# EAGLE design MS_Electron_SC (EAGLE 9.3.2)
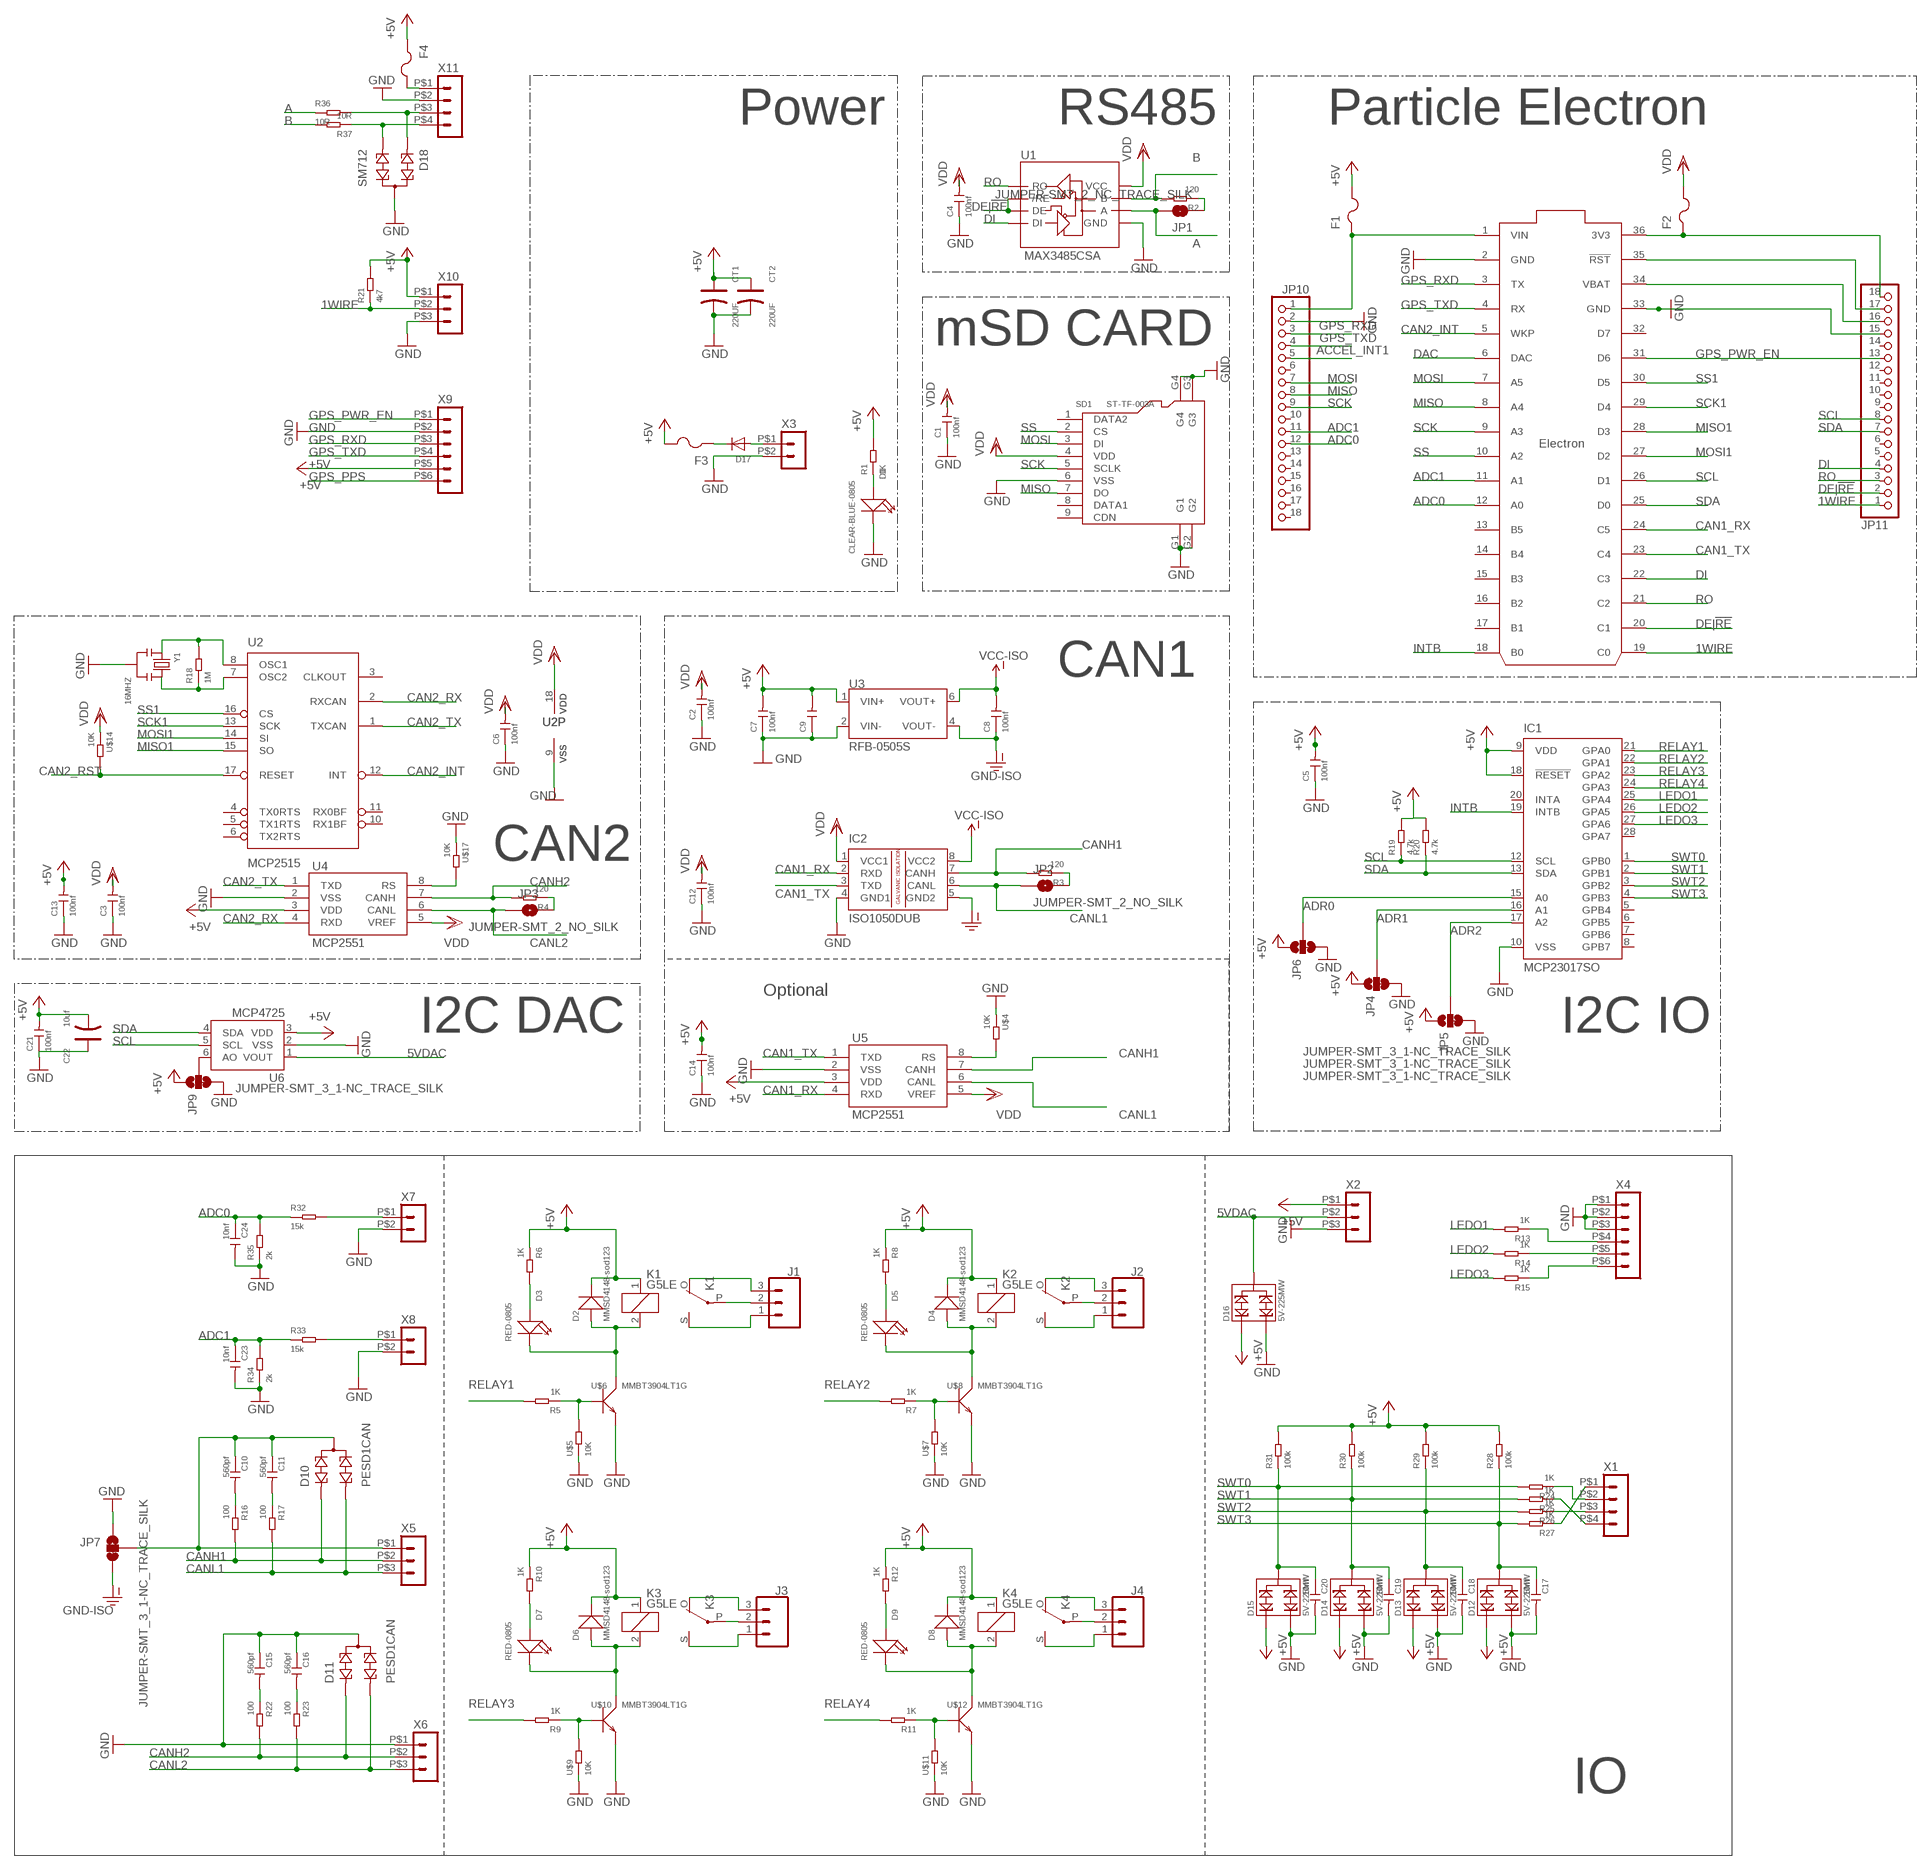
[diagram p0: schematic, sheet 1]

## Parts
C1  100nf  CERAMIC-100NF-50V-10%-X7R(0805)  [C0805]
C2  100nf  CERAMIC-100NF-50V-10%-X7R(0805)  [C0805]
C3  100nf  CERAMIC-100NF-50V-10%-X7R(0805)  [C0805]
C4  100nf  CERAMIC-100NF-50V-10%-X7R(0805)  [C0805]
C5  100nf  CERAMIC-100NF-50V-10%-X7R(0805)  [C0805]
C6  100nf  CERAMIC-100NF-50V-10%-X7R(0805)  [C0805]
C7  100nf  CERAMIC-100NF-50V-10%-X7R(0805)  [C0805]
C8  100nf  CERAMIC-100NF-50V-10%-X7R(0805)  [C0805]
C9  CERAMIC-22UF-16V-10%-X7R(1206)  [C1206]
C10  560pf  CERAMIC-10NF-50V-5%-X7R(0805)  [C0805]
C11  560pf  CERAMIC-10NF-50V-5%-X7R(0805)  [C0805]
C12  100nf  CERAMIC-100NF-50V-10%-X7R(0805)  [C0805]
C13  100nf  CERAMIC-100NF-50V-10%-X7R(0805)  [C0805]
C14  100nf  CERAMIC-100NF-50V-10%-X7R(0805)  [C0805]
C15  560pf  CERAMIC-10NF-50V-5%-X7R(0805)  [C0805]
C16  560pf  CERAMIC-10NF-50V-5%-X7R(0805)  [C0805]
C17  10nf  CERAMIC-10NF-50V-5%-X7R(0805)  [C0805]
C18  10nf  CERAMIC-10NF-50V-5%-X7R(0805)  [C0805]
C19  10nf  CERAMIC-10NF-50V-5%-X7R(0805)  [C0805]
C20  10nf  CERAMIC-10NF-50V-5%-X7R(0805)  [C0805]
C21  100nf  CERAMIC-100NF-50V-10%-X7R(0805)  [C0805]
C22  10uf  TANTALUM-SMD-10UF-10V-10%(AVX-A)  [AVX-A]
C23  10nf  CERAMIC-10NF-50V-5%-X7R(0805)  [C0805]
C24  10nf  CERAMIC-10NF-50V-5%-X7R(0805)  [C0805]
CT1  220UF  ALUMINUM-SMD-220UF-16V(D6.3-H7.7MM)  [ELECTRO-SMD-C-6MM]
CT2  220UF  ALUMINUM-SMD-220UF-16V(D6.3-H7.7MM)  [ELECTRO-SMD-C-6MM]
D1  CLEAR-BLUE-0805  SMD-LED-CLEAR-BLUE(0805)  [LED-0805]
D2  MMSD4148-sod123  SMD-DIODE-100V-200MA(SOD-123)  [SOD-123]
D3  RED-0805  SMD-LED-CLEAR-RED(0805)  [LED-0805]
D4  MMSD4148-sod123  SMD-DIODE-100V-200MA(SOD-123)  [SOD-123]
D5  RED-0805  SMD-LED-CLEAR-RED(0805)  [LED-0805]
D6  MMSD4148-sod123  SMD-DIODE-100V-200MA(SOD-123)  [SOD-123]
D7  RED-0805  SMD-LED-CLEAR-RED(0805)  [LED-0805]
D8  MMSD4148-sod123  SMD-DIODE-100V-200MA(SOD-123)  [SOD-123]
D9  RED-0805  SMD-LED-CLEAR-RED(0805)  [LED-0805]
D10  PESD1CAN  [SOT23]
D11  PESD1CAN  [SOT23]
D12  5V-225MW  SMD-DIODE-TVS-5V-225MW(SOT-23)  [SOT-23]
D13  5V-225MW  SMD-DIODE-TVS-5V-225MW(SOT-23)  [SOT-23]
D14  5V-225MW  SMD-DIODE-TVS-5V-225MW(SOT-23)  [SOT-23]
D15  5V-225MW  SMD-DIODE-TVS-5V-225MW(SOT-23)  [SOT-23]
D16  5V-225MW  SMD-DIODE-TVS-5V-225MW(SOT-23)  [SOT-23]
D17  DIODESMA  [SMADIODE]
D18  SM712  PESD1CAN  [SOT23]
F1  PTCFUSE-1812  [1812]
F2  PTCFUSE-1812  [1812]
F3  PTCFUSE-1812  [1812]
F4  PTCFUSE-1812  [1812]
IC1  MCP23017SO  [SO28W]
IC2  ISO1050DUB  [DUB-R-PDSO-G8]
J1  CONN_03SCREW  [SCREWTERMINAL-3.5MM-3]
J2  CONN_03SCREW  [SCREWTERMINAL-3.5MM-3]
J3  CONN_03SCREW  [SCREWTERMINAL-3.5MM-3]
J4  CONN_03SCREW  [SCREWTERMINAL-3.5MM-3]
JP1  JUMPER-SMT_2_NC_TRACE_SILK  [SMT-JUMPER_2_NC_TRACE_SILK]
JP2  JUMPER-SMT_2_NO_SILK  [SMT-JUMPER_2_NO_SILK]
JP3  JUMPER-SMT_2_NO_SILK  [SMT-JUMPER_2_NO_SILK]
JP4  JUMPER-SMT_3_1-NC_TRACE_SILK  [SMT-JUMPER_3_1-NC_TRACE_SILK]
JP5  JUMPER-SMT_3_1-NC_TRACE_SILK  [SMT-JUMPER_3_1-NC_TRACE_SILK]
JP6  JUMPER-SMT_3_1-NC_TRACE_SILK  [SMT-JUMPER_3_1-NC_TRACE_SILK]
JP7  JUMPER-SMT_3_1-NC_TRACE_SILK  [SMT-JUMPER_3_1-NC_TRACE_SILK]
JP9  JUMPER-SMT_3_1-NC_TRACE_SILK  [SMT-JUMPER_3_1-NC_TRACE_SILK]
JP10  PINHD-1X18-BIG  [1X18-BIG]
JP11  PINHD-1X18-BIG  [1X18-BIG]
K1  G5LE  [G5LE]
K2  G5LE  [G5LE]
K3  G5LE  [G5LE]
K4  G5LE  [G5LE]
R1  1K  SMD-RES-1K-5%-1/8W(0805)  [R0805]
R2  120  SMD-RES-120R-1%-1/8W(0805)  [R0805]
R3  120  SMD-RES-120R-1%-1/8W(0805)  [R0805]
R4  120  SMD-RES-120R-1%-1/8W(0805)  [R0805]
R5  1K  SMD-RES-1K-5%-1/8W(0805)  [R0805]
R6  1K  SMD-RES-1K-5%-1/8W(0805)  [R0805]
R7  1K  SMD-RES-1K-5%-1/8W(0805)  [R0805]
R8  1K  SMD-RES-1K-5%-1/8W(0805)  [R0805]
R9  1K  SMD-RES-1K-5%-1/8W(0805)  [R0805]
R10  1K  SMD-RES-1K-5%-1/8W(0805)  [R0805]
R11  1K  SMD-RES-1K-5%-1/8W(0805)  [R0805]
R12  1K  SMD-RES-1K-5%-1/8W(0805)  [R0805]
R13  1K  SMD-RES-1K-5%-1/8W(0805)  [R0805]
R14  1K  SMD-RES-1K-5%-1/8W(0805)  [R0805]
R15  1K  SMD-RES-1K-5%-1/8W(0805)  [R0805]
R16  100  SMD-RES-100R-1%-1/8W(0805)  [R0805]
R17  100  SMD-RES-100R-1%-1/8W(0805)  [R0805]
R18  1M  SMD-RES-1M-1%-1/8W(0805)  [R0805]
R19  4.7k  SMD-RES-4.7K-1%-1/8W(0805)  [R0805]
R20  4.7k  SMD-RES-4.7K-1%-1/8W(0805)  [R0805]
R21  4k7  SMD-RES-4.7K-1%-1/8W(0805)  [R0805]
R22  100  SMD-RES-100R-1%-1/8W(0805)  [R0805]
R23  100  SMD-RES-100R-1%-1/8W(0805)  [R0805]
R24  1K  SMD-RES-1K-5%-1/8W(0805)  [R0805]
R25  1K  SMD-RES-1K-5%-1/8W(0805)  [R0805]
R26  1K  SMD-RES-1K-5%-1/8W(0805)  [R0805]
R27  1K  SMD-RES-1K-5%-1/8W(0805)  [R0805]
R28  100k  SMD-RES-100K-1%-1/8W(0805)  [R0805]
R29  100k  SMD-RES-100K-1%-1/8W(0805)  [R0805]
R30  100k  SMD-RES-100K-1%-1/8W(0805)  [R0805]
R31  100k  SMD-RES-100K-1%-1/8W(0805)  [R0805]
R32  15k  SMD-RES-15K-5%-1/8W(0805)  [R0805]
R33  15k  SMD-RES-15K-5%-1/8W(0805)  [R0805]
R34  2k  SMD-RES-2K-1%-1/8W(0805)  [R0805]
R35  2k  SMD-RES-2K-1%-1/8W(0805)  [R0805]
R36  10R  SMD-RES-4.7K-1%-1/8W(0805)  [R0805]
R37  10R  SMD-RES-4.7K-1%-1/8W(0805)  [R0805]
SD1  ST-TF-003A  MICRO-SD-CARD-SOCKET-9P(ST-TF-003A)  [MICRO-SD9+4P-SMD-16.1X14.5X1.85MM]
U1  MAX3485CSA  RS485SOIC  [SO08]
U2  MCP2515  MCP2515(MCP2510)SO  [SO18W]
U3  RFB-0505S  [RFB-0505S]
U4  MCP2551  [SO08]
U5  MCP2551  [SO08]
U6  MCP4725  MCP4725SOT-23  [SOT23-6]
U$1  ELECTRON_WITH_HEADERS  [ELECTRON]
U$4  10K  SMD-RES-10K-1%-1/8W(0805)  [R0805]
U$5  10K  SMD-RES-10K-1%-1/8W(0805)  [R0805]
U$6  MMBT3904LT1G  SMD-TRANSISTORS-NPN-40V-200MA-MMBT3904LT1G(SOT-23)  [SOT-23]
U$7  10K  SMD-RES-10K-1%-1/8W(0805)  [R0805]
U$8  MMBT3904LT1G  SMD-TRANSISTORS-NPN-40V-200MA-MMBT3904LT1G(SOT-23)  [SOT-23]
U$9  10K  SMD-RES-10K-1%-1/8W(0805)  [R0805]
U$10  MMBT3904LT1G  SMD-TRANSISTORS-NPN-40V-200MA-MMBT3904LT1G(SOT-23)  [SOT-23]
U$11  10K  SMD-RES-10K-1%-1/8W(0805)  [R0805]
U$12  MMBT3904LT1G  SMD-TRANSISTORS-NPN-40V-200MA-MMBT3904LT1G(SOT-23)  [SOT-23]
U$14  10K  SMD-RES-10K-1%-1/8W(0805)  [R0805]
U$17  10K  SMD-RES-10K-1%-1/8W(0805)  [R0805]
X1  HEADER_POS4_43045-0401  [43045-0400]
X2  HEADER_POS3_43650-0300  [43650-0300]
X3  HEADER_POS2_43650-0200  [43650-0200]
X4  HEADER_POS6_43045-0600  [43045-0600]
X5  HEADER_POS3_43650-0300  [43650-0300]
X6  HEADER_POS3_43650-0300  [43650-0300]
X7  HEADER_POS2_43650-0200  [43650-0200]
X8  HEADER_POS2_43650-0200  [43650-0200]
X9  HEADER_POS6_43045-0600  [43045-0600]
X10  HEADER_POS3_43650-0300  [43650-0300]
X11  HEADER_POS4_43045-0401  [43045-0400]
Y1  16MHZ  SMD-RESONATOR-16MHZ-15PF-0.5%-40R(3P-3.2X1.3MM)  [X3-SMD-3.6X1.3X0.8MM]

## Nets
1WIRE: JP11.1 R21.1 U$1.19(C0) X10.P$2
5VDAC: D16.3 U6.1(VOUT) X2.P$2
+5V: C5.2 C7.2 C9.2 C13.2 C14.2 C21.2 C22.- CT1.+ CT2.+ D2.- D4.- D6.- D8.- D12.1 D13.1 D14.1 D15.1 D16.1 F1.2 F3.2 F4.1 IC1.9(VDD) IC1.18(!RESET) JP4.1 JP5.1 JP6.1 JP9.1 K1.1 K2.1 K3.1 K4.1 R1.2 R6.1 R8.1 R10.1 R12.1 R19.2 R20.2 R21.2 R28.2 R29.2 R30.2 R31.2 U3.1(VIN+) U4.3(VDD) U5.3(VDD) U6.3(VDD) X2.P$1 X9.P$5 X10.P$1
A: JP1.2 R36.1 U1.6(A)
ACCEL_INT1: JP10.5
ADC0: C24.1 JP10.12 R32.1 R35.2 U$1.12(A0)
ADC1: C23.1 JP10.11 R33.1 R34.2 U$1.11(A1)
ADR0: IC1.15(A0) JP6.2
ADR1: IC1.16(A1) JP4.2
ADR2: IC1.17(A2) JP5.2
B: R2.2 R37.2 U1.7(B)
CAN1_RX: IC2.2(RXD) U5.4(RXD) U$1.24(C5)
CAN1_TX: IC2.3(TXD) U5.1(TXD) U$1.23(C4)
CAN2_INT: U2.12(INT) U$1.5(WKP)
CAN2_RST: U2.17(RESET) U$14.2
CAN2_RX: U2.2(RXCAN) U4.4(RXD)
CAN2_TX: U2.1(TXCAN) U4.1(TXD)
CANH1: D10.1 IC2.7(CANH) R3.2 R16.2 U5.7(CANH) X5.P$2
CANH2: D11.1 R4.2 R22.2 U4.7(CANH) X6.P$2
CANL1: D10.2 IC2.6(CANL) JP2.1 R17.2 U5.6(CANL) X5.P$3
CANL2: D11.2 JP3.1 R23.2 U4.6(CANL) X6.P$3
DAC: U$1.6(DAC)
DE|!RE: JP11.2 U1.2(/RE) U1.3(DE) U$1.20(C1)
DI: JP11.4 U1.4(DI) U$1.22(C3)
GND: C1.1 C2.1 C3.1 C4.1 C5.1 C6.1 C7.1 C9.1 C12.1 C13.1 C14.1 C15.1 C16.1 C17.2 C18.2 C19.2 C20.2 C21.1 C22.+ C23.2 C24.2 CT1.- CT2.- D1.- D11.3 D12.2 D13.2 D14.2 D15.2 D16.2 D18.3 IC1.10(VSS) IC2.4(GND1) JP4.3 JP5.3 JP6.3 JP7.1 JP9.3 JP10.2 JP11.15 R34.1 R35.1 SD1.6(VSS) SD1.G1 SD1.G2 SD1.G3 SD1.G4 U1.5(GND) U2.9(VSS) U3.2(VIN-) U4.2(VSS) U5.2(VSS) U6.2(VSS) U$1.2(GND) U$1.33(GND) U$4.1 U$5.1 U$6.2(E) U$7.1 U$8.2(E) U$9.1 U$10.2(E) U$11.1 U$12.2(E) U$17.1 X2.P$3 X3.P$2 X4.P$1 X4.P$2 X4.P$3 X6.P$1 X7.P$2 X8.P$2 X9.P$2 X10.P$3 X11.P$2 Y1.2
GND-ISO: C8.1 IC2.5(GND2) JP7.3 U3.4(VOUT-)
GPS_PPS: X9.P$6
GPS_PWR_EN: JP11.13 U$1.31(D6) X9.P$1
GPS_RXD: JP10.3 U$1.3(TX) X9.P$3
GPS_TXD: JP10.4 U$1.4(RX) X9.P$4
INTB: IC1.19(INTB) U$1.18(B0)
LEDO1: IC1.25(GPA4) R13.2
LEDO2: IC1.26(GPA5) R14.2
LEDO3: IC1.27(GPA6) R15.2
MISO: JP10.8 SD1.7(DO) U$1.8(A4)
MISO1: U2.15(SO) U$1.28(D3)
MOSI: JP10.7 SD1.3(DI) U$1.7(A5)
MOSI1: U2.14(SI) U$1.27(D2)
N$1: D1.+ R1.1
N$2: JP2.2 R3.1
N$3: JP1.1 R2.1
N$4: JP3.2 R4.1
N$5: R5.1 U$5.2 U$6.1(B)
N$6: D2.+ D3.- K1.2 U$6.3(C)
N$7: D3.+ R6.2
N$8: J1.2 K1.P(2:P)
N$9: J1.3 K1.O(2:O)
N$10: J1.1 K1.S(2:S)
N$11: D4.+ D5.- K2.2 U$8.3(C)
N$12: R7.1 U$7.2 U$8.1(B)
N$13: D5.+ R8.2
N$14: J3.2 K3.P(2:P)
N$15: J2.3 K2.O(2:O)
N$16: J2.1 K2.S(2:S)
N$17: D6.+ D7.- K3.2 U$10.3(C)
N$18: R9.1 U$9.2 U$10.1(B)
N$19: D7.+ R10.2
N$20: J2.2 K2.P(2:P)
N$21: J3.3 K3.O(2:O)
N$22: J3.1 K3.S(2:S)
N$23: D8.+ D9.- K4.2 U$12.3(C)
N$24: R11.1 U$11.2 U$12.1(B)
N$25: D9.+ R12.2
N$26: J4.2 K4.P(2:P)
N$27: J4.3 K4.O(2:O)
N$28: J4.1 K4.S(2:S)
N$29: R14.1 X4.P$5
N$30: R13.1 X4.P$4
N$32: R15.1 X4.P$6
N$35: F2.1 JP11.18 U$1.36(3V3)
N$36: U5.8(RS) U$4.2
N$37: C11.2 R17.1
N$38: C10.2 R16.1
N$39: R18.1 U2.7(OSC2) Y1.3
N$40: R18.2 U2.8(OSC1) Y1.1
N$41: C10.1 C11.1 D10.3 JP7.2 X5.P$1
N$42: C16.2 R23.1
N$43: U4.8(RS) U$17.2
N$44: C15.2 R22.1
N$45: R24.1 X1.P$2
N$46: R27.1 X1.P$1
N$47: R25.1 X1.P$4
N$48: R26.1 X1.P$3
N$49: JP9.2 U6.6(AO)
N$50: R33.2 X8.P$1
N$51: R32.2 X7.P$1
N$52: JP11.17 U$1.35(!RST)
N$53: JP11.16 U$1.34(VBAT)
N$54: F1.1 JP10.1 U$1.1(VIN)
N$55: D17.A X3.P$1
N$56: D17.C F3.1
N$57: D18.1 R36.2 X11.P$3
N$58: D18.2 R37.1 X11.P$4
N$60: F4.2 X11.P$1
RELAY1: IC1.21(GPA0) R5.2
RELAY2: IC1.22(GPA1) R7.2
RELAY3: IC1.23(GPA2) R9.2
RELAY4: IC1.24(GPA3) R11.2
RO: JP11.3 U1.1(RO) U$1.21(C2)
SCK: JP10.9 SD1.5(SCLK) U$1.9(A3)
SCK1: U2.13(SCK) U$1.29(D4)
SCL: IC1.12(SCL) JP11.8 R19.1 U6.5(SCL) U$1.26(D1)
SDA: IC1.13(SDA) JP11.7 R20.1 U6.4(SDA) U$1.25(D0)
SS: SD1.2(CS) U$1.10(A2)
SS1: U2.16(CS) U$1.30(D5)
SWT0: C20.1 D15.3 IC1.1(GPB0) R24.2 R31.1
SWT1: C19.1 D14.3 IC1.2(GPB1) R25.2 R30.1
SWT2: C18.1 D13.3 IC1.3(GPB2) R26.2 R29.1
SWT3: C17.1 D12.3 IC1.4(GPB3) R27.2 R28.1
VCC-ISO: C8.2 IC2.8(VCC2) U3.6(VOUT+)
VDD: C1.2 C2.2 C3.2 C4.2 C6.2 C12.2 F2.2 IC2.1(VCC1) SD1.4(VDD) U1.8(VCC) U2.18(VDD) U4.5(VREF) U5.5(VREF) U$14.1
Unconnected: IC1.5(GPB4) IC1.6(GPB5) IC1.7(GPB6) IC1.8(GPB7) IC1.20(INTA) IC1.28(GPA7) JP10.6 JP10.10 JP10.13 JP10.14 JP10.15 JP10.16 JP10.17 JP10.18 JP11.5 JP11.6 JP11.9 JP11.10 JP11.11 JP11.12 JP11.14 SD1.1(DATA2) SD1.8(DATA1) SD1.9(CDN) U2.3(CLKOUT) U2.4(TX0RTS) U2.5(TX1RTS) U2.6(TX2RTS) U2.10(RX1BF) U2.11(RX0BF) U$1.13(B5) U$1.14(B4) U$1.15(B3) U$1.16(B2) U$1.17(B1) U$1.32(D7)

## Notes on the sheet
- Power | RS485 | Particle Electron
- mSD CARD
- CAN1
- CAN2
- Optional
- I2C DAC | I2C IO
- IO

## Library data of the parts
C1-C8 C12-C14 C21 = OPL_Capacitor:CERAMIC-100NF-50V-10%-X7R(0805): 302010165; MPN: CC0805KRX7R9BB104
C9 = OPL_Capacitor:CERAMIC-22UF-16V-10%-X7R(1206): 302010182
C10 C11 C15 C16 = OPL_Capacitor:CERAMIC-10NF-50V-5%-X7R(0805): 302010175; MPN: CC0805JRX7R9BB103; VALUE: 10nf
C17-C20 C23 C24 = OPL_Capacitor:CERAMIC-10NF-50V-5%-X7R(0805): 302010175; MPN: CC0805JRX7R9BB103
C22 = OPL_Capacitor:TANTALUM-SMD-10UF-10V-10%(AVX-A): 302020011; MPN: TAJA106K010RNJ
CT1 CT2 = OPL_Capacitor:ALUMINUM-SMD-220UF-16V(D6.3-H7.7MM): 302030053; MPN: CS1E221M-CRE77
D1 = OPL_Optoelectronics:SMD-LED-CLEAR-BLUE(0805): 304090061; MPN: EL-17-215/BHC-AN1P2/3T
D2 D4 D6 D8 = OPL_Discrete_Semiconductor:SMD-DIODE-100V-200MA(SOD-123): 304010007; MPN: MMSD4148
D3 D5 D7 D9 = OPL_Optoelectronics:SMD-LED-CLEAR-RED(0805): 304090046; MPN: 17-215SURC/S530-A2/TR8
D10 D11 D18 = diode:PESD1CAN: CAN bus ESD protection diode Source: http://www.nxp.com/documents/data_sheet/PESD1CAN.pdf
D12-D16 = OPL_Circuit_Protection:SMD-DIODE-TVS-5V-225MW(SOT-23): 304050003; MPN: CESD5V0AP
D17 = adafruit:DIODE: Diode SMADIODE - SMA Surface Mount Package 20V 1A Schottky Diode Digikey: 641-1014-6-ND DO-1N4148 - Through Hole Small Current Diode SOD-123 20V 1 A (.5mV Vf) Schottky Diode - Digikey: MBRX120TPMSCT-ND SOD-323 10V 570mA (.38mV Vf, 3ns) Schottky Diode - Digikey: ZLLS410CT-ND SOD-523 30V 30mA Schottky Diode (RB751S-40TE61) - Digikey: RB751S-40TE61CT-ND SOT23-R/W - SOT23 Package (R = Solder Paste/Reflow Ovens, W = Hand-Soldering) BAT54Film 40V 300mA - Digikey: 497-7162-1-ND
F1-F4 = adafruit:PTCFUSE: PTC fuses, resettable thermistors
IC1 = adafruit:MCP23017: http://ww1.microchip.com/downloads/en/DeviceDoc/21952a.pdf Source: http://ww1.microchip.com/downloads/en/DeviceDoc/21952a.pdf
IC2 = texas:ISO1050: ISOLATED CAN TRANSCEIVER Source: http://focus.ti.com/lit/ds/symlink/iso1050.pdf; MPN: ISO1050DUBR; OC_FARNELL: 1755712; OC_NEWARK: 14R9899
J1-J4 = SparkFun-Connectors:CONN_03: Multi connection point. Often used as Generic Header-pin footprint for 0.1 inch spaced/style header connections On any of the 0.1 inch spaced packages, you can populate with these: Break Away Headers - Straight <https://www.sparkfun.com/products/116> (PRT-00116) Break Away Male Headers - Right Angle <https://www.sparkfun.com/products/553> (PRT-00553) Female Headers <https://www.sparkfun.com/products/115> (PRT-00115) Break Away Headers - Machine Pin <https://www.sparkfun.com/products/117> (PRT-00117) Break Away Female Headers - Swiss Machine Pin <https://www.sparkfun.com/products/743> (PRT-00743) Stackable Header - 3 Pin (Female, 0.1") <https://www.sparkfun.com/products/13875> (PRT-13875) For SCREWTERMINALS and SPRING TERMINALS visit here: Screw Terimnals on SparkFun.com <https://www.sparkfun.com/search/results?term=Screw+Terminals> (5mm/3.5mm/2.54mm spacing) This device is also useful as a general connection point to wire up your design to another part of your project. Our various solder wires solder well into these plated through hole pads. Hook-Up Wire - Assortment (Stranded, 22 AWG) <https://www.sparkfun.com/products/11375> (PRT-11375) Hook-Up Wire - Assortment (Solid Core, 22 AWG) <https://www.sparkfun.com/products/11367> (PRT-11367) View the entire wire category on our website here <https://www.sparkfun.com/categories/141> Special notes: Molex polarized connector foot print use with SKU : PRT-08232 with associated crimp pins and housings.; PROD_ID: CONN-08288; SF_ID: PRT-08235
JP1 = SparkFun-Jumpers:JUMPER-SMT_2_NC_TRACE: Normally closed trace jumper This jumper has a trace between two pads so it's normally closed (NC). Use a razor knife to open the connection. For best results follow the IPC guidelines for cutting traces: Cutout at least 0.063 mm (0.005 in). Remove all loose material to clean up the cut area. Seal the cut with an approved epoxy. Reapply solder to reclose the connection.
JP2 JP3 = SparkFun-Jumpers:JUMPER-SMT_2_NO: Normally open jumper This jumper has two pads in close proximity to each other. Apply solder to close the connection. Round pads are easier to solder for beginners, but are a lot larger. SparkFun Product that uses the round pads: SparkFun EL Sequencer <https://www.sparkfun.com/products/12781>
JP4-JP7 JP9 = SparkFun-Jumpers:JUMPER-SMT_3_1-NC_TRACE: Normally closed trace jumper (1 of 2 connections) This jumper has a trace between two pads so it's normally closed (NC). The other connection is normally open (NO). Use a razor knife to open the connection. For best results follow the IPC guidelines for cutting traces: Cutout at least 0.063 mm (0.005 in). Remove all loose material to clean up the cut area. Seal the cut with an approved epoxy. Reapply solder to reclose the connection, or to close the NO connection.
JP10 JP11 = adafruit:PINHD-1X18: PIN HEADER
K1-K4 = relay:G5LE: RELAY 1 x switch, 10 A/120 V AC, 8 A/30 V DC, Omron; OC_FARNELL: unknown; OC_NEWARK: unknown
R1 R5-R15 R24-R27 = OPL_Resistor:SMD-RES-1K-5%-1/8W(0805): 301012189; MPN: RC0805JR-071KL
R2-R4 = OPL_Resistor:SMD-RES-120R-1%-1/8W(0805): 301012153; MPN: RC0805JR-071KL; VALUE: 1K
R16 R17 R22 R23 = OPL_Resistor:SMD-RES-100R-1%-1/8W(0805): 301012151; MPN: RC0805JR-071KL; VALUE: 1K
R18 = OPL_Resistor:SMD-RES-1M-1%-1/8W(0805): 301012157; MPN: RC0805JR-071KL; VALUE: 1K
R19-R21 R36 R37 = OPL_Resistor:SMD-RES-4.7K-1%-1/8W(0805): 301012175; MPN: RC0805JR-071KL; VALUE: 1K
R28-R31 = OPL_Resistor:SMD-RES-100K-1%-1/8W(0805): 301012150; MPN: RC0805JR-071KL; VALUE: 1K
R32 R33 = OPL_Resistor:SMD-RES-15K-5%-1/8W(0805): 301012186; MPN: RC0805JR-071KL; VALUE: 1K
R34 R35 = OPL_Resistor:SMD-RES-2K-1%-1/8W(0805): 301012164; MPN: RC0805JR-071KL; VALUE: 1K
SD1 = OPL_Connector:MICRO-SD-CARD-SOCKET-9P(ST-TF-003A): 320090000; MPN: ST-TF-003A
U1 = SparkFun-IC-Comms:RS485: RS-485 Transceiver SP3485 Series 8 Pin NSOIC 3.3 V Low Power Half Duplex RS-485 Transceiver MAX3485 compatible Datasheet <http://www.sparkfun.com/datasheets/Components/General/sp3485CN-LTR.pdf> SparkFun Products SparkFun Transceiver Breakout - RS-485 <https://www.sparkfun.com/products/10124> (BOB-10124) SparkFun USB to RS-485 Converter <https://www.sparkfun.com/products/9822> (BOB-09822); PROD_ID: IC-09388
U2 = SparkFun-IC-Comms:MCP2515(MCP2510): CAN controller with SPI interface The MCP2515 controller supercedes the MCP2510 while addressing all errata associated with it. The two devices are pin compatible, either can be used with this device. 18-pin package SOIC Simple SPI interface to any MCU. One-shot mode ensures message transmission is attempted only once Databyte filtering Start-of-Frame (SOF) output Low-power CMOS Technology Datasheet <http://www.sparkfun.com/datasheets/DevTools/Arduino/MCP2515.pdf> SparkFun Products CAN-BUS Shield <https://www.sparkfun.com/products/13262> (DEV-13262); PROD_ID: IC-09906
U3 = SparkFun-IC-Power:RFB-0505S: Recom Power RFB-0505S 1W DC/DC Converter This 1W DC/DC converter keeps two power supplies magnetically isolated. Supplies up to 200 mA @ 5V.; PROD_ID: IC-14143
U4 U5 = SparkFun-IC-Comms:MCP2551: MCP2551 High Speed CAN Transceiver High speed CAN transceiver Datasheet <http://www.sparkfun.com/datasheets/DevTools/Arduino/MCP2551.pdf> SparkFun Products CAN-BUS Shield <https://www.sparkfun.com/products/13262> (DEV-13262) SparkFun OBD-II UART <https://www.sparkfun.com/products/9555> (WIG-09555); PROD_ID: IC-09907
U6 = SparkFun-IC-Conversion:MCP4725: MCP4725 DAC Microchip 12-bit I2C DAC, SOT23-6 Datasheet <https://cdn.sparkfun.com/datasheets/BreakoutBoards/MCP4725_2009.pdf> SparkFun Products SparkFun I2C DAC Breakout - MCP4725 <https://www.sparkfun.com/products/12918> (BOB-12918); PROD_ID: IC-08886
U$1 = Particle-Devices:ELECTRON: The Particle Electron is a tiny development kit for creating cellular-connected electronics projects and products. It comes with a SIM card (Nano 4FF) and an affordable data plan for low-bandwidth things. Design files : here <https://github.com/particle-iot/electron> Product Page : Datasheet <https://docs.particle.io/datasheets/electron-(cellular)/electron-datasheet/> Github : Particle devices library <https://github.com/particle-iot/hardware-libraries/tree/master/Eagle>
U$4 U$5 U$7 U$9 U$11 U$14 U$17 = OPL_Resistor:SMD-RES-10K-1%-1/8W(0805): 301012152; MPN: RC0805FR-0710KL
U$6 U$8 U$10 U$12 = OPL_Discrete_Semiconductor:SMD-TRANSISTORS-NPN-40V-200MA-MMBT3904LT1G(SOT-23): 305010013; MPN: MMBT3904LT1G
X1 X11 = con-molex-micro-fit-3_0:HEADER_POS4_?: Molex - Micro-Fit 3.0 Series connector, 3.00mm (0.118") pitch header, 4 positions.
X2 X5 X6 X10 = con-molex-micro-fit-3_0:HEADER_POS3_?: Molex - Micro-Fit 3.0 Series connector, 3.00mm (0.118") pitch header, 3 positions.
X3 X7 X8 = con-molex-micro-fit-3_0:HEADER_POS2_?: Molex - Micro-Fit 3.0 Series connector, 3.00mm (0.118") pitch header, 2 positions.
X4 X9 = con-molex-micro-fit-3_0:HEADER_POS6_?: Molex - Micro-Fit 3.0 Series connector, 3.00mm (0.118") pitch header, 6 positions.
Y1 = OPL_Crystal Oscillator:SMD-RESONATOR-16MHZ-15PF-0.5%-40R(3P-3.2X1.3MM): 306030002; MPN: CSTCE16M0V53-R0

## Board
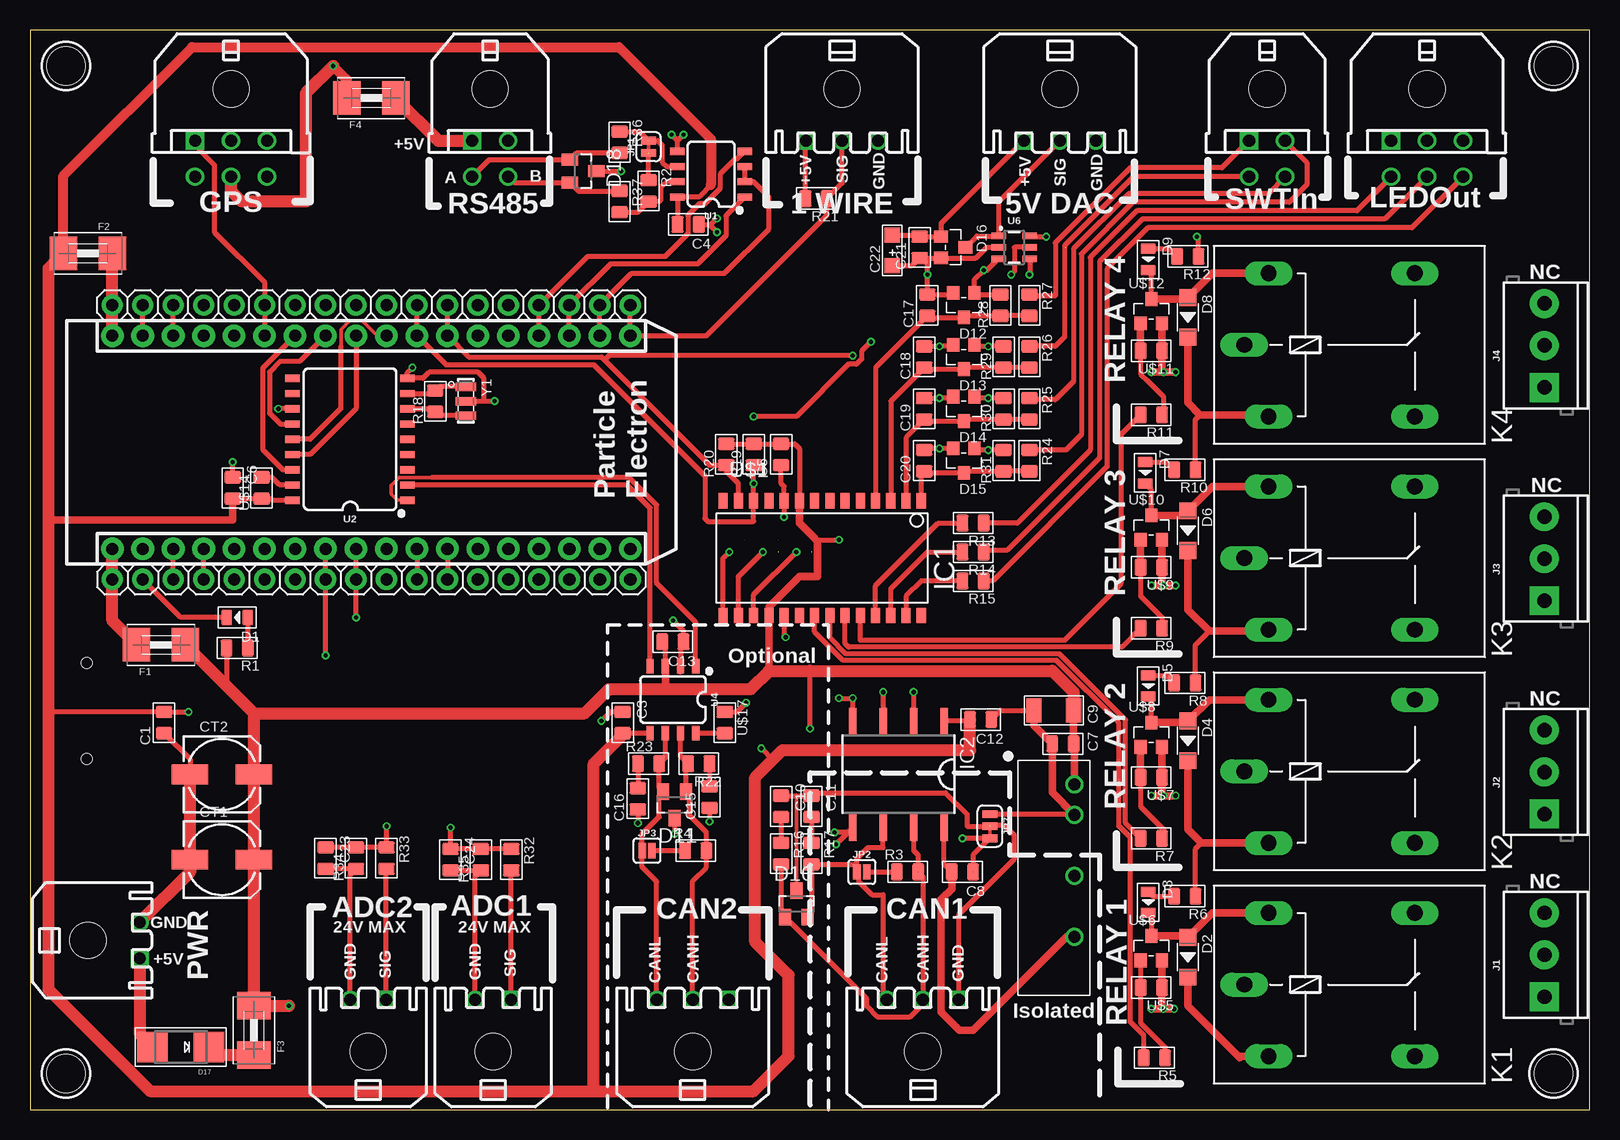
[diagram p1: board, top side]
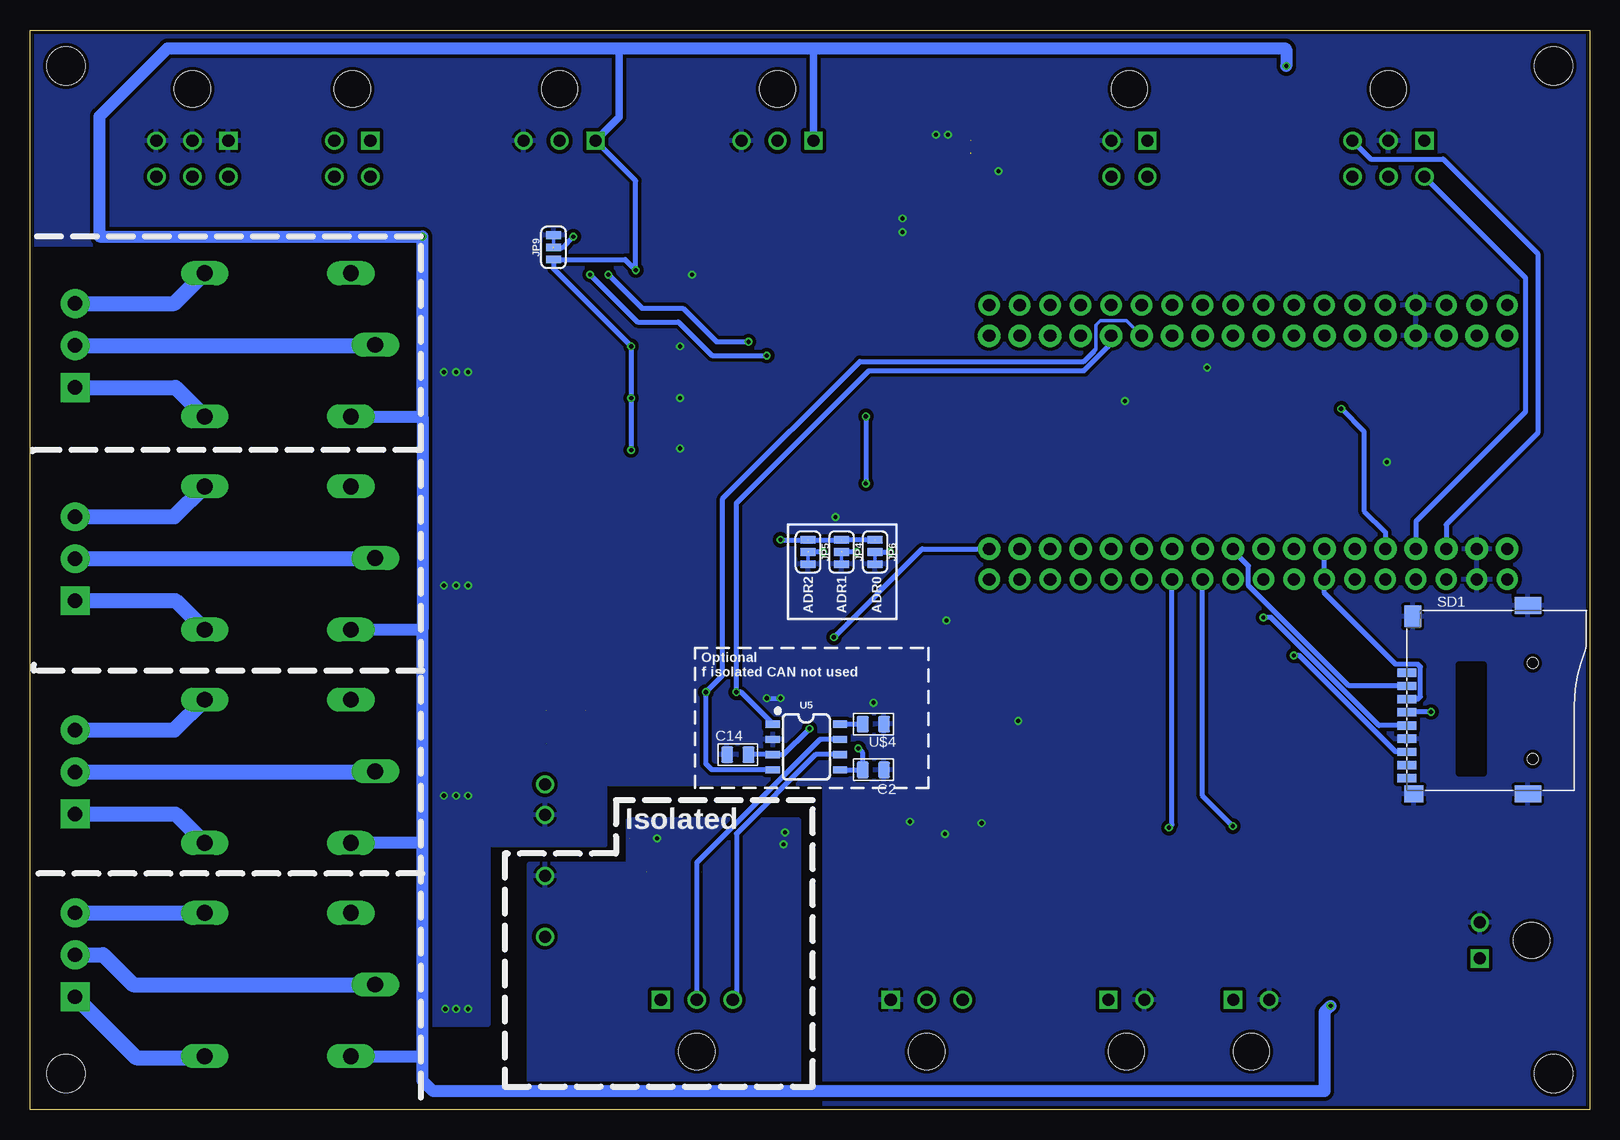
[diagram p2: board, bottom side, seen from below]

Size 130 x 90 mm. Coordinates in mm from the lower left corner, seen from the top.
Outline: 0,0 130,0 130,90 0,90 0,0
Copper layers (1*2*15*16): Top 0.035mm / dielectric 0.2mm / Route2 0.0175mm / dielectric 1.1mm / Route15 0.0175mm / dielectric 0.2mm / Bottom 0.035mm
Design rules "SeeedStudio_DRU_no_angle_20130527": minimum track width 6mil, minimum drill 12mil, track to track 6mil, track to pad 6mil, pad to pad 6mil, via to via 6mil, smd to smd 0mil, copper to edge 10mil, drill to drill 10mil, minimum pad ring 6mil, minimum via ring 6mil, stop-mask expansion 2mil, vias tented up to drill 25mil, thermal gap 10mil
Holes 3.2 mm at 3,3 127,3 127,87 3,87

### Footprints (pad centres in the part's own frame; a part is rotated, then mirrored left to right if it is on the bottom)
C0805 = smd 1.397 x 1.016: 1 0,0.889; 2 0,-0.889
C1206 = smd 1.27 x 2.032: 1 -1.651,0; 2 1.651,0
AVX-A = smd 1.27 x 1.27: + -1.27,0; - 1.27,0
ELECTRO-SMD-C-6MM = smd 3.048 x 1.651: + 2.667,0; - -2.667,0
LED-0805 = smd 0.889 x 1.27: + -0.889,0; - 0.889,0
SOD-123 = smd 1.397 x 1.397: + -1.651,0; - 1.651,0
SOT23 = smd 1 x 1.4: 1 -0.95,-1.1; 2 0.95,-1.1; 3 0,1.1
SOT-23 = smd 1.016 x 1.143: 1 -0.889,-1.016; 2 0.889,-1.016; 3 0,1.016
SMADIODE = smd 2.54 x 2.54: A 2.349,0; C -2.349,0
1812 = smd 2.286 x 2.794: 1 -2.046,0; 2 2.046,0
SO28W = smd 0.762 x 1.27: 1 -7.62,-4.78; 2 -6.35,-4.78; 3 -5.08,-4.78; 4 -3.81,-4.78; 5 -2.54,-4.78; 6 -1.27,-4.78; 7 0,-4.78; 8 1.27,-4.78; 9 2.54,-4.78; 10 3.81,-4.78; 11 5.08,-4.78; 12 6.35,-4.78; 13 7.62,-4.78; 14 8.89,-4.78; 15 8.89,4.78; 16 7.62,4.78; 17 6.35,4.78; 18 5.08,4.78; 19 3.81,4.78; 20 2.54,4.78; 21 1.27,4.78; 22 0,4.78; 23 -1.27,4.78; 24 -2.54,4.78; 25 -3.81,4.78; 26 -5.08,4.78; 27 -6.35,4.78; 28 -7.62,4.78
DUB-R-PDSO-G8 = smd 0.6 x 2.2: 1 -3.81,-4.445; 2 -1.27,-4.445; 3 1.27,-4.445; 4 3.81,-4.445; 5 3.81,4.445; 6 1.27,4.445; 7 -1.27,4.445; 8 -3.81,4.445
SCREWTERMINAL-3.5MM-3 = drill 1.2 pad 2.413 square: 1 0,0 | drill 1.2 pad 2.413: 2 3.5,0; 3 7,0
SMT-JUMPER_2_NC_TRACE_SILK = smd 0.635 x 1.27: 1 -0.508,0; 2 0.508,0
SMT-JUMPER_2_NO_SILK = smd 0.635 x 1.27: 1 -0.406,0; 2 0.406,0
SMT-JUMPER_3_1-NC_TRACE_SILK = smd 0.635 x 1.27: 1 -1.016,0; 2 0,0; 3 1.016,0
1X18-BIG = drill 1.016 pad 1.778: 1 -21.59,0; 2 -19.05,0; 3 -16.51,0; 4 -13.97,0; 5 -11.43,0; 6 -8.89,0; 7 -6.35,0; 8 -3.81,0; 9 -1.27,0; 10 1.27,0; 11 3.81,0; 12 6.35,0; 13 8.89,0; 14 11.43,0; 15 13.97,0; 16 16.51,0; 17 19.05,0; 18 21.59,0
G5LE = drill 1.321 long: 1 -7.493,-5.969; 2 -7.493,5.969; O 4.699,5.969; P -9.525,0; S 4.699,-5.969
R0805 = smd 1.397 x 1.016: 1 0,0.889; 2 0,-0.889
MICRO-SD9+4P-SMD-16.1X14.5X1.85MM = smd 1.6 x 0.7: 1 0,2.25; 2 0,1.15; 3 0,0.05; 4 0,-1.05; 5 0,-2.15; 6 0,-3.25; 7 0,-4.35; 8 0,-5.45; 9 0,-6.55 | smd 1.6 x 1.4: G1 0.6,-7.85 | smd 2.2 x 1.4: G2 10.1,-7.85; G3 10.1,7.85 | smd 1.4 x 1.8: G4 0.5,6.95 | hole 0.9: 10.5,-4.95; 10.5,3.05
SO08 = smd 0.6 x 1.2: 1 -1.905,-2.8; 2 -0.635,-2.8; 3 0.635,-2.8; 4 1.905,-2.8; 5 1.905,2.8; 6 0.635,2.8; 7 -0.635,2.8; 8 -1.905,2.8
SO18W = smd 0.6 x 1.2: 1 -5.08,-4.788; 2 -3.81,-4.788; 3 -2.54,-4.788; 4 -1.27,-4.788; 5 0,-4.788; 6 1.27,-4.788; 7 2.54,-4.788; 8 3.81,-4.788; 9 5.08,-4.788; 10 5.08,4.788; 11 3.81,4.788; 12 2.54,4.788; 13 1.27,4.788; 14 0,4.788; 15 -1.27,4.788; 16 -2.54,4.788; 17 -3.81,4.788; 18 -5.08,4.788
RFB-0505S = drill 1: 1 -7.8,1.73; 2 -5.26,1.73; 4 -0.18,1.73; 6 4.9,1.73
SOT23-6 = smd 0.55 x 1.2: 1 0.95,1.3; 2 0,1.3; 3 -0.95,1.3; 4 -0.95,-1.3; 5 0,-1.3; 6 0.95,-1.3
ELECTRON = drill 1.016 pad 1.88: 1 1.27,46.99; 2 1.27,44.45; 3 1.27,41.91; 4 1.27,39.37; 5 1.27,36.83; 6 1.27,34.29; 7 1.27,31.75; 8 1.27,29.21; 9 1.27,26.67; 10 1.27,24.13; 11 1.27,21.59; 12 1.27,19.05; 13 1.27,16.51; 14 1.27,13.97; 15 1.27,11.43; 16 1.27,8.89; 17 1.27,6.35; 18 1.27,3.81; 19 19.05,3.81; 20 19.05,6.35; 21 19.05,8.89; 22 19.05,11.43; 23 19.05,13.97; 24 19.05,16.51; 25 19.05,19.05; 26 19.05,21.59; 27 19.05,24.13; 28 19.05,26.67; 29 19.05,29.21; 30 19.05,31.75; 31 19.05,34.29; 32 19.05,36.83; 33 19.05,39.37; 34 19.05,41.91; 35 19.05,44.45; 36 19.05,46.99
43045-0400 = drill 1.02 square: P$1 1.5,4.32 | drill 1.02: P$2 -1.5,4.32; P$3 1.5,7.32; P$4 -1.5,7.32 | hole 3: 0,0
43650-0300 = drill 1.02 square: P$1 3,4.32 | drill 1.02: P$2 0,4.32; P$3 -3,4.32 | hole 3: 0,0
43650-0200 = drill 1.02 square: P$1 1.5,4.32 | drill 1.02: P$2 -1.5,4.32 | hole 3: 0,0
43045-0600 = drill 1.02 square: P$1 3,4.32 | drill 1.02: P$2 0,4.32; P$3 -3,4.32; P$4 3,7.32; P$5 0,7.32; P$6 -3,7.32 | hole 3: 0,0
X3-SMD-3.6X1.3X0.8MM = smd 0.7 x 1.7: 1 -1.2,0; 2 0,0; 3 1.2,0

### Placement (x,y rotation side)
C1  11.18,32.26 180 top
C2  59.69,28.32 270 bottom
C3  49.4,32.26 0 top
C4  54.86,73.79 270 top
C5  62.61,54.61 180 top
C6  16.89,51.82 0 top
C7  86.11,30.48 90 top
C8  77.72,19.81 270 top
C9  85.34,33.27 0 top
C10  62.61,25.27 0 top
C11  65.15,25.27 0 top
C12  79.25,32.51 270 top
C13  53.59,38.99 270 top
C14  70.99,29.59 90 bottom
C15  56.64,26.04 180 top
C16  50.67,25.91 180 top
C17  74.8,67.06 180 top
C18  74.55,62.74 180 top
C19  74.55,58.42 180 top
C20  74.55,54.1 180 top
C21  74.17,71.88 180 top
C22  71.88,71.63 90 top
C23  24.64,20.95 0 top
C24  35.05,20.83 0 top
CT1  16,20.83 0 top
CT2  16,27.94 0 top
D1  17.27,41.02 180 top
D2  96.52,12.7 270 top
D3  93.22,17.27 270 top
D4  96.52,30.73 270 top
D5  93.22,35.31 270 top
D6  96.52,48.26 270 top
D7  92.96,53.09 270 top
D8  96.52,66.04 270 top
D9  93.22,70.87 270 top
D10  63.88,17.14 0 top
D11  53.72,25.4 180 top
D12  77.85,67.06 180 top
D13  77.85,62.74 180 top
D14  77.85,58.42 180 top
D15  77.85,54.1 180 top
D16  76.96,71.88 270 top
D17  12.57,5.21 180 top
D18  46.1,78.23 270 top
F1  10.92,38.73 0 top
F2  4.83,71.37 180 top
F3  18.67,6.6 90 top
F4  28.45,84.33 0 top
IC1  66.67,45.97 180 top
IC2  72.39,27.94 180 top
J1  126.24,9.4 90 top
J2  126.24,24.64 90 top
J3  126.24,42.42 90 top
J4  126.24,60.2 90 top
JP1  51.56,80.26 90 top
JP2  69.34,19.81 0 top
JP3  51.44,21.59 0 top
JP4  62.36,46.48 270 bottom
JP5  65.15,46.48 270 bottom
JP6  59.56,46.48 270 bottom
JP7  80.01,23.62 270 top
JP9  86.36,71.88 90 bottom
JP10  28.45,44.2 0 top
JP11  28.45,67.06 180 top
K1  110.74,10.41 0 top
K2  110.74,28.19 0 top
K3  110.74,45.97 0 top
K4  110.74,63.75 0 top
R1  17.27,38.48 270 top
R2  51.56,76.58 0 top
R3  73.15,19.81 90 top
R4  55.5,21.59 90 top
R5  93.73,4.32 270 top
R6  96.27,17.78 270 top
R7  93.47,22.61 270 top
R8  96.27,35.56 270 top
R9  93.47,40.13 270 top
R10  96.27,53.34 270 top
R11  93.47,57.91 270 top
R12  96.52,71.12 270 top
R13  78.61,48.9 270 top
R14  78.61,46.48 270 top
R15  78.61,44.07 270 top
R16  62.61,21.34 0 top
R17  65.15,21.34 0 top
R18  33.78,59.05 180 top
R19  60.33,54.61 180 top
R20  58.04,54.61 180 top
R21  65.53,75.95 270 top
R22  55.75,28.83 270 top
R23  51.56,28.83 90 top
R24  83.31,54.1 0 top
R25  83.31,58.42 0 top
R26  83.31,62.74 0 top
R27  83.31,67.06 0 top
R28  80.9,67.06 180 top
R29  81.15,62.74 180 top
R30  81.15,58.42 180 top
R31  81.15,54.1 180 top
R32  40.13,20.83 0 top
R33  29.72,20.95 0 top
R34  27.18,20.95 180 top
R35  37.59,20.83 180 top
R36  49.15,80.64 0 top
R37  49.15,75.69 0 top
SD1  15.24,34.16 0 bottom
U1  56.77,77.98 90 top
U2  26.67,55.88 90 top
U3  85.34,19.3 270 top
U4  53.59,34.16 180 top
U5  65.28,30.23 270 bottom
U6  82.04,71.88 90 top
U$1  53.85,45.47 90 top
U$4  59.69,32.13 270 bottom
U$5  93.47,10.16 270 top
U$6  93.47,13.46 0 top
U$7  93.47,27.69 270 top
U$8  93.47,31.24 0 top
U$9  93.47,45.21 270 top
U$10  93.47,48.51 0 top
U$11  93.47,63.25 270 top
U$12  93.47,66.55 0 top
U$14  19.3,51.82 180 top
U$17  57.91,32.26 0 top
X1  103.12,85.09 180 top
X2  85.85,85.09 180 top
X3  4.83,14.1 270 top
X4  116.46,85.09 180 top
X5  74.42,4.83 0 top
X6  55.24,4.83 0 top
X7  38.61,4.83 0 top
X8  28.19,4.83 0 top
X9  16.76,85.09 180 top
X10  67.69,85.09 180 top
X11  38.35,85.09 180 top
Y1  36.32,59.05 270 top

### Tracks (layer width: path | path; a pad name or v marks a point on that pad's centre or on a via)
1WIRE
  Top 0.406: X10.P$2 67.69,77.22 R21.1 66.42,74.55 56.39,64.52 U$1.19 JP11.1
5VDAC
  Top 0.406: D16.3 78.93,72.83 U6.1 80.74,75.66 X2.P$2
+5V  (via drill 0.35)  (6 unrouted)
  Top 0.406: R6.1 97.16,21.72 97.66,22.23 | R12.1 97.41,72.64 v97.28,72.77 | R10.1 97.16,57.53 97.54,57.91 | R8.1 97.16,38.73 98.3,39.88 | R31.2 v79.88,54.99 78.87,54.99 D15.1 | R30.2 v79.88,59.31 78.87,59.31 D14.1 | R29.2 v79.88,63.63 78.87,63.63 D13.1 | R28.2 78.87,67.94 D12.1 78.74,69.22 v79.5,69.98 79.79,69.98 U6.3 | IC1.9 64.14,55.12 63.75,55.5 C5.2 R19.2 | R20.2 R19.2 | 60.83,55.5 R19.2 | C22.- 74.04,72.9 C21.2 D16.1 75.95,73.86 X2.P$1 | U4.3 52.96,38.73 C13.2 | R1.2 16.38,35.32 16.39,35.31 | 65.28,47.75 65.53,47.5 v67.44,47.5 | R21.2 64.64,80.72 X10.P$1 | v65.02,31.75 65.02,36.58
  Top 0.61: D2.- 96.52,8.64 100.84,4.32 100.97,4.45 K1.1 | D4.- 96.52,23.37 97.66,22.23 K2.1 | D6.- 96.52,41.66 98.3,39.88 103.12,39.88 K3.1 | D8.- 96.52,58.93 97.54,57.91 103.12,57.91 K4.1 | U3.1 87.07,30.4 C7.2 C9.2 | 61.59,36.32 61.59,36.58 IC1.18 61.59,41.91 64.14,44.45 65.66,44.45 65.66,47.37 65.28,47.75 64.14,48.9 IC1.9 | U4.3 52.96,35.05
  Top 0.813: F4.1 26.4,85.87 v25.27,87
  Top 1.016: 18.67,33.03 CT2.+ CT1.+ F3.2 21.58,8.65 v21.59,8.64 | 18.67,33.03 16.39,35.31 F1.2 | 18.67,33.03 46.24,33.03 48.26,35.05 52.96,35.05 60.07,35.05 61.59,36.58 65.02,36.58 85.22,36.58 87,34.8 C9.2 | 26.42,84.34 F4.1 | v25.27,87 22.99,84.71 22.99,75.69 17.65,75.69 16.76,76.58 X9.P$5
  Bottom 0.406: JP6.1 JP4.1 JP5.1 v67.44,47.5 | C14.2 U5.3 67.18,29.59 v65.02,31.75 | X2.P$1 79.5,77.42 v79.5,69.98 80.39,70.87 JP9.1 86.36,70.1 v79.88,63.63 v79.88,59.31 v79.88,54.99
  Bottom 0.61: X2.P$1 80.9,82.72 80.9,88.48 | X10.P$1 64.69,88.4 64.77,88.48
  Bottom 1.016: 97.28,22.23 K2.1 | 97.28,4.45 97.28,22.23 | 97.28,22.23 97.28,40.01 | 97.28,57.78 97.28,40.01 | K1.1 97.28,4.45 | K3.1 97.28,40.01 | K4.1 97.28,57.78 | 97.28,57.78 v97.28,72.77 124.21,72.77 124.21,82.8 118.53,88.48 80.9,88.48 64.77,88.48 25.36,88.48 25.27,88.39 v25.27,87 | v21.59,8.64 22.1,8.13 22.1,1.52 96.39,1.52 97.28,2.41 97.28,4.45
A  (1 unrouted)
  Top 0.406: R36.1 50.8,81.53 51.51,80.82 51.56,80.82 | JP1.2 52.32,80.77 52.7,80.39 52.7,78.99 53.09,78.61 U1.6
ADC0  (via drill 0.35)
  Top 0.406: R32.1 R35.2 C24.1 v35.05,23.5 | U$1.12 JP10.12
  Bottom 0.406: v35.05,23.5 34.8,23.75 JP10.12
ADC1  (via drill 0.35)
  Top 0.406: C23.1 R34.2 R33.1 v29.72,23.62 | U$1.11 JP10.11
  Bottom 0.406: v29.72,23.62 32.26,26.16 JP10.11
ADR0  (via drill 0.35)
  Top 0.406: IC1.15 57.78,45.97 v58.29,46.48
  Bottom 0.406: JP6.2 v58.29,46.48
ADR1  (via drill 0.35)  (1 unrouted)
  Top 0.406: IC1.16 59.05,44.45 v61.09,46.48
  Bottom 0.406: v61.09,46.48 62.03,46.48 62.08,46.53 62.36,46.53
ADR2  (via drill 0.35)  (1 unrouted)
  Top 0.406: IC1.17 60.33,42.93 v63.88,46.48
  Bottom 0.406: v63.88,46.48 64.83,46.48 64.88,46.53 65.15,46.53
B
  Top 0.406: R37.2 50.67,74.8 R2.2 52.45,75.69 52.58,75.82 52.58,76.83 53.09,77.34 U1.7
CAN1_RX  (via drill 0.35)
  Top 0.406: v73.66,34.8 IC2.2
  Bottom 0.305: 41.27,63.25 41.15,63.37 41.15,65.41 40.77,65.79 38.61,65.79 U$1.24
  Bottom 0.406: U5.4 73.15,28.32 73.66,28.83 v73.66,34.8 72.26,36.2 72.26,50.93 60.83,62.36 42.16,62.36 41.27,63.25
CAN1_TX  (via drill 0.35)
  Top 0.406: v71.12,34.8 IC2.3
  Bottom 0.406: U5.1 70.75,34.8 v71.12,34.8 71.12,50.55 60.07,61.59 42.14,61.59 39.88,63.85 U$1.23
CAN2_INT  (via drill 0.35)
  Top 0.406: U2.12 v20.7,58.42
  Bottom 0.406: v20.7,58.42 18.8,56.52 18.8,49.91 17.02,48.13 U$1.5
CAN2_RST
  Top 0.406: U2.17 20.83,52.07 20.19,52.7 U$14.2
CAN2_RX
  Top 0.406: U4.4 51.69,50.16 49.78,52.07 U2.2
CAN2_TX
  Top 0.305: 33.53,52.7 30.76,52.7 30.13,52.07 30.1,52.07 30.1,51.31 30.61,50.8 U2.1
  Top 0.406: U4.1 55.5,40.64 52.25,43.89 52.25,50.4 49.94,52.7 33.53,52.7
CANH1  (1 unrouted)
  Top 0.406: IC2.7 73.66,21.59 74.04,21.21 R3.2 74.42,19.43 X5.P$2 74.42,8.76 73.41,7.75 70.61,7.75 69.72,8.64 69.72,9.25 D10.1 62.61,16.36 R16.2
  Bottom 0.406: U5.7 64.14,30.86 74.42,20.57 X5.P$2
CANH2
  Top 0.406: X6.P$2 55.24,19.05 56.39,20.19 R4.2 56.39,23.11 54.99,24.51 54.99,26.18 D11.1 54.67,28.64 R22.2 54.23,29.46 U4.7
CANL1
  Top 0.406: 68.94,20.32 JP2.1 69.08,19.67 69.08,19.03 70.2,17.91 71.12,17.91 71.12,9.45 X5.P$3 | 68.94,20.32 68.94,20.93 69.85,21.84 71.12,21.84 IC2.6 | 68.94,20.32 68.81,20.45 R17.2 65.15,16.36 D10.2
  Bottom 0.406: U5.6 64.52,29.59 71.12,22.99 71.12,9.45 X5.P$3
CANL2
  Top 0.406: X6.P$3 52.24,19 51.03,20.22 JP3.1 51.03,22.96 52.45,24.38 52.45,26.18 D11.2 52.45,26.82 R23.2 52.96,29.34 U4.6
DE|!RE
  Top 0.406: U1.3 U1.2 60.33,77.34 61.59,76.07 61.59,73.41 57.91,69.72 50.16,69.72 JP11.2 U$1.20
DI
  Top 0.406: U$1.22 JP11.4 46.48,71.12 52.94,71.12 54.84,73.02 54.84,74.56 55.79,75.51 56.27,75.51 57.53,76.77 57.53,77.98 58.82,79.27 58.95,79.27 U1.4
GND  (via drill 0.35)  (1 unrouted)
  Top 0.406: C12.1 80.9,33.27 C9.1 | 68.58,31.75 IC2.4 v68.58,34.29 v67.44,34.29 | JP7.1 87,24.64 U3.2 | Y1.2 37.72,59.05 | 37.72,59.05 37.85,59.18 37.85,60.96 37.34,61.47 33.27,61.47 32.77,60.96 U2.9 31.46,61.43 v31.88,61.85 | D12.2 76.83,67.94 C17.2 v74.8,69.6 74.8,70.99 | C18.2 v75.82,63.63 76.83,63.63 D13.2 | C19.2 v75.82,59.31 76.83,59.31 D14.2 | C20.2 74.68,55.12 v75.82,55.12 D15.2 | C5.1 62.61,52.2 62.87,51.94 IC1.10 v62.87,49.4 | U6.2 79.76,71.88 78.87,70.99 D16.2 74.8,70.99 | 74.8,70.99 C21.1 73.53,70.36 C22.+ | 37.72,59.05 v38.73,59.05 | D11.3 v53.72,22.99 | C16.1 v50.67,23.88 | C15.1 v56.64,24 | 54.23,36.45 U4.2 54.23,38.73 C13.1 54.48,39.88 v53.59,40.77 | C6.1 v16.89,53.98 | C23.2 R34.1 26.69,19.58 X8.P$2 | C24.2 R35.1 37.11,19.45 X7.P$2 | C1.1 13.34,29.21 CT2.- | D1.- 12.57,41.02 JP10.2 | C3.1 48.39,33.15 v47.62,32.38 | U$17.1 58.93,33.15 v59.69,33.91 | v53.47,81.28 53.97,80.78 U1.5 53.97,80.77 v54.48,81.28 | v57.28,74.3 56.77,73.79 C4.1 56.64,73.79 v57.28,73.15 | D18.3 v49.28,78.23
  Top 0.61: U$6.2 U$5.1 94.36,8.51 v94.49,8.38 | v94.49,8.38 v93.47,8.38 | U$8.2 U$7.1 94.36,26.29 v94.49,26.16 | U$12.2 U$11.1 94.36,61.59 v94.49,61.47 | U$10.2 U$9.1 94.36,43.81 v94.49,43.69 | v94.49,61.47 v93.47,61.47 | v94.49,61.47 v95.5,61.47 | v94.49,43.69 v93.47,43.69 | v94.49,43.69 v95.5,43.69 | v94.49,26.16 v93.47,26.16 | v94.49,26.16 v95.5,26.16 | C9.1 83.69,32 C7.1 85.22,26.42 U3.2 | v94.49,8.38 v95.38,8.38
  Top 1.016: CT2.- CT1.- 13.34,19.79 X3.P$2
  Bottom 0.406: v68.58,34.29 v67.44,34.29
  pour Bottom (isolate 0.305): 0,0 0,90 130,90 130,72.14 97.03,72.14 97.03,7.11 91.78,7.11 91.78,22.1 82.04,22.1 82.04,27.18 63.75,27.18 63.75,0
GND-ISO  (via drill 0.35)  (2 unrouted)
  Top 0.406: C8.1 78.61,21.21 JP7.3 v77.72,22.61 | v67.06,23.11 68.2,23.11 IC2.5 v67.18,22.1
  pour Bottom (isolate 0.305): 65.91,0 65.91,24.13 80.14,24.13 80.14,20.45 88.39,20.45 88.39,0
GPS_PWR_EN
  Top 0.406: X9.P$1 13.76,80.34 15.37,78.74 15.37,73.15 19.56,68.96 JP11.13 U$1.31
GPS_RXD
  Top 0.406: JP10.3 U$1.3
  Bottom 0.406: X9.P$3 18.24,79.25 12.19,79.25 4.32,71.37 4.32,56.39 11.94,48.77 U$1.3
GPS_TXD
  Top 0.406: JP10.4 U$1.4
  Bottom 0.406: X9.P$4 5.33,69.34 5.33,58.17 14.48,49.02 U$1.4
INTB  (via drill 0.35)
  Top 0.406: IC1.19 62.87,39.5 v62.99,39.37
  Bottom 0.406: v62.99,39.37 55.63,46.74 U$1.18
LEDO1
  Top 0.406: IC1.25 70.48,43.69 75.69,48.9 R13.2
LEDO2
  Top 0.406: IC1.26 71.75,43.43 74.8,46.48 R14.2
LEDO3
  Top 0.406: IC1.27 73.03,42.8 74.3,44.07 R15.2 77.66,44.01
MISO  (via drill 0.35)
  Top 0.406: v24.64,37.85 JP10.8 U$1.8
  Bottom 0.406: SD1.7 15.25,29.83 16.15,29.83 24.17,37.85 v24.64,37.85
MISO1
  Top 0.406: U$1.28 27.18,58.42 23.37,54.61 U2.15
MOSI
  Bottom 0.406: SD1.3 15.23,34.23 14.29,34.23 14.08,34.44 14.08,36.91 14.29,37.12 16.16,37.12 22.1,43.05 JP10.7 U$1.7
MOSI1
  Top 0.305: U$1.27 28.94,64.52 27.69,65.76 26.66,65.76 25.93,65.03 25.93,63.65 25.91,63.63
  Top 0.406: 25.91,63.63 25.91,58.42 23.37,55.88 U2.14
N$1
  Top 0.406: D1.+ R1.1
N$2
  Top 0.406: JP2.2 R3.1
N$3  (1 unrouted)
  Top 0.406: R2.1 51.56,79.7
N$4
  Top 0.406: JP3.2 R4.1
N$5
  Top 0.406: U$6.1 U$5.2 92.58,7.24 94.61,5.21 R5.1
N$6
  Top 0.406: D3.- 93.47,16.13 U$6.3
  Top 0.61: U$6.3 96.39,14.48 D2.+ 98.55,16.38 K1.2
N$7
  Top 0.406: D3.+ 93.6,17.78 R6.2
N$8
  Bottom 1.27: J1.2 123.9,12.9 121.41,10.41 K1.P
N$9
  Bottom 1.27: J1.3 115.46,16.4 K1.O
N$10
  Bottom 1.27: J1.1 121.16,4.32 115.57,4.32 K1.S
N$11
  Top 0.406: U$8.3 93.47,34.16 D5.-
  Top 0.61: U$8.3 96.39,32.26 D4.+ 98.3,34.16 K2.2
N$12
  Top 0.406: U$7.2 92.58,25.27 94.49,23.37 94.49,22.73 R7.1
  Top 0.61: U$7.2 U$8.1
N$13
  Top 0.406: D5.+ 94.74,36.2 R8.2
N$14
  Bottom 1.27: J3.2 101.28,45.92 K3.P
N$15
  Bottom 1.27: J2.3 117.97,31.64 K2.O
N$16
  Bottom 1.27: J2.1 117.86,24.64 K2.S
N$17
  Top 0.406: U$10.3 93.47,51.69 D7.-
  Top 0.61: U$10.3 96.14,49.53 D6.+ 98.55,51.94 K3.2
N$18
  Top 0.406: U$9.2 92.58,42.8 94.36,41.02 R9.1
  Top 0.61: U$10.1 U$9.2
N$19
  Top 0.406: D7.+ 94.74,53.98 R10.2
N$20
  Bottom 1.27: J2.2 101.28,28.14 K2.P
N$21
  Bottom 1.27: J3.3 117.97,49.42 K3.O
N$22
  Bottom 1.27: J3.1 117.86,42.42 K3.S
N$23
  Top 0.406: U$12.3 93.47,69.72 D9.-
  Top 0.61: U$12.3 96.39,67.56 D8.+ 98.55,69.72 K4.2
N$24
  Top 0.406: U$11.2 92.58,61.32 93.17,60.73 93.19,60.73 94.49,59.44 94.49,58.04 R11.1
  Top 0.61: U$12.1 U$11.2
N$25
  Top 0.406: D9.+ 95,71.75 R12.2
N$26
  Bottom 1.27: J4.2 101.22,63.7 K4.P
N$27
  Bottom 1.27: J4.3 117.97,67.2 K4.O
N$28
  Bottom 1.27: J4.1 117.86,60.2 K4.S
N$29
  Top 0.406: R14.1 79.63,46.61 81.44,46.61 89.15,54.33 89.15,70.68 92.72,74.24 112.93,74.24 X4.P$5
N$30
  Top 0.406: X4.P$4 110.62,74.93 92.28,74.93 88.39,71.04 88.39,54.99 82.3,48.9 R13.1
N$32
  Top 0.406: R15.1 80.26,44.07 89.79,53.59 89.79,70.1 93.2,73.5 115.19,73.5 X4.P$6
N$35
  Top 1.016: U$1.36 JP11.18 6.86,71.36 F2.1
N$36
  Bottom 0.406: U5.8 U$4.2
N$37
  Top 0.406: C11.2 R17.1
N$38
  Top 0.406: C10.2 R16.1
N$39
  Top 0.406: U2.7 33.53,58.42 R18.1 34.09,57.85 Y1.3
N$40
  Top 0.406: U2.8 33.53,59.69 R18.2 34.09,60.26 Y1.1
N$41  (1 unrouted)
  Top 0.305: D10.3 63.88,26.16
  Top 0.406: X5.P$1 77.42,16.26 82.04,20.88 82.04,22.86 81.23,23.67 80.01,23.67 79.74,23.67 79.69,23.62 79.63,23.62 78.11,23.62 78.11,24.64 76.33,26.42 65.41,26.42 C11.1 63.88,26.16 C10.1
N$42
  Top 0.406: R23.1 C16.2
N$43
  Top 0.406: U$17.2 U4.8
N$44
  Top 0.406: R22.1 C15.2
N$45
  Top 0.406: X1.P$2 106.43,78.97 106.43,77.09 104.98,75.64 91.95,75.64 87.63,71.33 87.63,56.26 86.36,54.99 R24.1
N$46
  Top 0.406: X1.P$1 99.36,78.51 91.72,78.51 85.47,72.26 85.47,67.82 83.44,67.82 R27.1
N$47
  Top 0.406: X1.P$4 103.23,76.38 91.61,76.38 87,71.75 87,60.71 85.47,59.18 83.44,59.18 R25.1
N$48
  Top 0.406: R26.1 85.47,63.63 86.23,64.39 86.23,72.01 91.99,77.77 X1.P$3
N$49  (via drill 0.35)  (1 unrouted)
  Top 0.406: U6.6 83.4,72.77 v84.71,72.77
  Bottom 0.406: v84.71,72.77 85.65,71.83 86.36,71.83
N$50
  Top 0.406: X8.P$1 29.69,20.04 R33.2
N$51
  Top 0.406: X7.P$1 40.11,19.91 R32.2
N$52
  Top 0.406: U$1.35 JP11.17
N$53
  Top 0.406: U$1.34 JP11.16
N$54
  Top 1.016: F1.1 6.86,40.75 JP10.1 U$1.1
N$55
  Top 1.016: X3.P$1 9.15,6.29 D17.A
N$56
  Top 1.016: D17.C 15.57,4.56 F3.1
N$57
  Top 0.406: X11.P$3 38.27,79.18 D18.1 45.58,79.76 R36.2
N$58
  Top 0.406: X11.P$4 40.34,77.28 D18.2 45.7,76.58 R37.1
N$60
  Top 1.016: F4.2 34.05,80.77 X11.P$1
RELAY1
  Top 0.406: R5.2 92.84,6.2 91.72,7.31 91.72,22.68 90.75,23.64 90.75,32.26 85.58,37.44 67.79,37.44 65.41,39.82 IC1.21
RELAY2
  Top 0.406: R7.2 91.31,23.88 91.31,32.49 85.81,38 68.02,38 66.67,39.34 IC1.22
RELAY3
  Top 0.406: IC1.23 67.94,38.86 68.25,38.56 91.01,38.56 R9.2
RELAY4
  Top 0.406: R11.2 90.93,56.26 90.93,43.81 86.23,39.12 69.22,39.12 IC1.24
RO
  Top 0.406: U$1.21 JP11.3 48.39,70.48 55.65,70.48 58.01,72.85 58.01,74.52 U1.1
SCK  (via drill 0.35)
  Top 0.406: v27.18,41.02 JP10.9 U$1.9
  Bottom 0.406: SD1.5 17.53,32.01 17.54,32.03 17.56,32.03 26.55,41.02 v27.18,41.02
SCK1
  Top 0.406: U$1.29 22.48,62.36 20.83,62.36 19.97,61.5 19.97,58.06 20.88,57.15 U2.13
SCL  (via drill 0.35)
  Top 0.406: R19.1 v60.33,52.2 IC1.12 60.33,49.02 56.52,49.02 56.26,49.28 56.26,52.83 46.99,62.1 34.67,62.1 U$1.26 JP11.8 | U6.5 82.04,71.88 82.04,69.85 v81.79,69.6 | v60.33,57.78 63.88,57.78 68.23,62.13 68.88,62.13 69.31,62.56 69.31,63.22 v70.1,64.01
  Bottom 0.406: v81.79,69.6 78.99,66.8 75.56,66.8 72.77,64.01 v70.1,64.01 | v60.33,57.78 v60.33,52.2
SDA  (via drill 0.35)
  Top 0.406: IC1.13 59.05,52.2 58.04,53.21 R20.1 56.64,53.72 47.88,62.48 | JP11.7 U$1.25 36.58,62.74 47.62,62.74 47.88,62.48 | U6.4 83.34,69.5 83.31,69.47 v83.31,69.6 | 47.88,62.48 48.26,62.87 v68.58,62.87
  Bottom 0.406: v83.31,69.6 79.38,65.66 75.95,65.66 73.15,62.87 v68.58,62.87
SS
  Bottom 0.406: SD1.2 20.05,35.31 28.42,43.68 28.42,45.31 29.72,46.61 U$1.10
SS1
  Top 0.406: U2.16 21.08,53.34 19.41,55.01 19.41,61.83 U$1.30
SWT0
  Top 0.406: R24.2 R31.1 77.98,53.21 D15.3 74.68,53.09 C20.1 74.3,52.96 IC1.1
SWT1
  Top 0.406: IC1.2 73.03,56.01 C19.1 74.68,57.4 D14.3 77.98,57.53 R30.1 R25.2
SWT2
  Top 0.406: IC1.3 71.75,59.05 C18.1 74.68,61.72 D13.3 77.98,61.85 R29.1 R26.2
SWT3
  Top 0.406: IC1.4 70.48,61.85 C17.1 74.93,66.04 D12.3 77.98,66.17 R28.1 R27.2
VCC-ISO
  Top 0.406: C8.2 76.2,20.45 IC2.8
  Top 0.61: U3.6 86.41,14.4 78.61,6.6 77.47,6.6 75.95,8.13 75.95,17.53 76.83,18.41 C8.2
VDD  (via drill 0.35)
  Top 0.406: C12.2 78.23,32.38 IC2.1 | U4.5 49.53,31.36 C3.2 | C6.2 U$14.1 20.07,50.93 20.19,50.8 U2.18 | 1.52,33.02 1.65,33.15 C1.2 v13.21,33.15 | C4.2 U1.8 55.75,76.07 56.77,77.09 | v60.96,30.1 61.91,29.15
  Top 0.61: C6.2 16.89,49.15 1.52,49.15
  Top 0.813: F2.2 2.78,77.84 13.52,88.58 49.09,88.58 56.77,80.9 56.77,77.09
  Top 1.016: F2.2 1.52,70.12 1.52,49.15 1.52,33.02 1.52,10.03 10.03,1.52 46.99,1.52 | 46.99,1.52 46.99,28.82 49.53,31.36 | 46.99,1.52 60.33,1.52 63.25,4.45 63.25,11.21 60.45,14 60.45,27.69 61.91,29.15 62.74,29.97 78.36,29.97 C12.2
  Bottom 0.406: U5.5 C2.2 60.58,29.72 v60.96,30.1 | v13.21,33.15 15.21,33.15 SD1.4

### Text on the board
tPlace: +5V | A | B | +5V | SIG | GND | +5V | SIG | GND | GPS | RS485 | 1 WIRE | 5V DAC | SWTIn | LEDOut | NC | RELAY 4 | Particle / Electron | NC | RELAY 3 | Optional | NC | RELAY 2 | NC | ADC2 | ADC1 | CAN2 | CAN1 | GND | 24V MAX | 24V MAX | +5V | PWR | GND | SIG | GND | SIG | CANL | CANH | CANL | CANH | GND | Isolated | RELAY 1
bPlace: ADR0 | ADR1 | ADR2 | Optional / f isolated CAN not used | Isolated